# EAGLE schematic project (EAGLE 9.7.0)
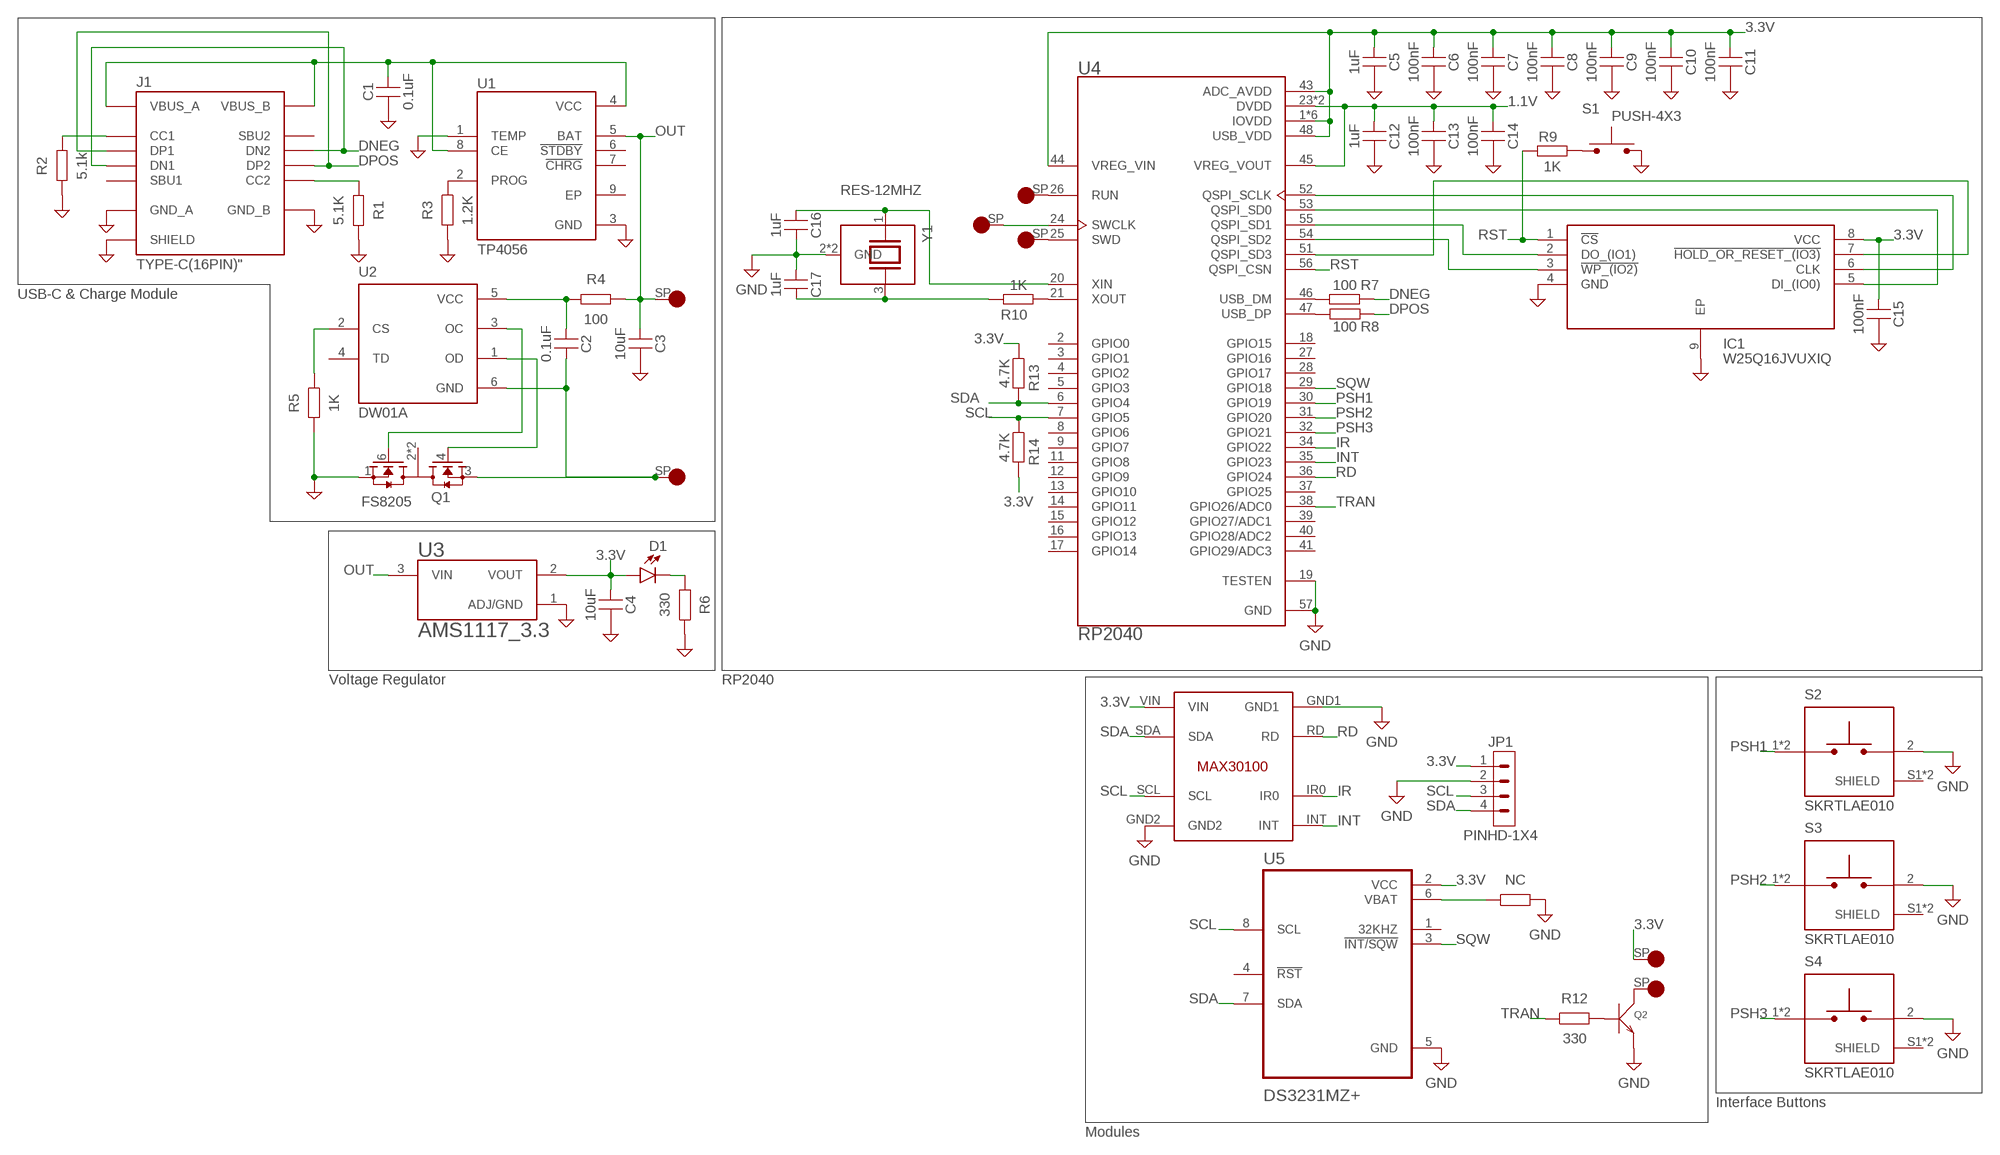
[diagram p0: schematic, sheet 1]

## Parts
B+  SOLDER_PAD_2MM  [SOLDER_PAD_2MM]
B-  SOLDER_PAD_2MM  [SOLDER_PAD_2MM]
C1  0.1uF  C_CHIP-0805(2012-METRIC)  [CAPC2012X110]
C2  0.1uF  C_CHIP-0805(2012-METRIC)  [CAPC2012X110]
C3  10uF  C_CHIP-0805(2012-METRIC)  [CAPC2012X110]
C4  10uF  C_CHIP-0805(2012-METRIC)  [CAPC2012X110]
C5  1uF  C_CHIP-0805(2012-METRIC)  [CAPC2012X110]
C6  100nF  C_CHIP-0805(2012-METRIC)  [CAPC2012X110]
C7  100nF  C_CHIP-0805(2012-METRIC)  [CAPC2012X110]
C8  100nF  C_CHIP-0805(2012-METRIC)  [CAPC2012X110]
C9  100nF  C_CHIP-0805(2012-METRIC)  [CAPC2012X110]
C10  100nF  C_CHIP-0805(2012-METRIC)  [CAPC2012X110]
C11  100nF  C_CHIP-0805(2012-METRIC)  [CAPC2012X110]
C12  1uF  C_CHIP-0805(2012-METRIC)  [CAPC2012X110]
C13  100nF  C_CHIP-0805(2012-METRIC)  [CAPC2012X110]
C14  100nF  C_CHIP-0805(2012-METRIC)  [CAPC2012X110]
C15  100nF  C_CHIP-0805(2012-METRIC)  [CAPC2012X110]
C16  1uF  C_CHIP-0805(2012-METRIC)  [CAPC2012X110]
C17  1uF  C_CHIP-0805(2012-METRIC)  [CAPC2012X110]
D1  LED0805  [LEDC2012X70N]
IC1  W25Q16JVUXIQ  [SON50P300X200X60-9N]
J1  TYPE-C(16PIN)"  [TYPE-C(16PIN)]
JP1  PINHD-1X4  [1X04]
NC  R_CHIP-0402(1005-METRIC)  [RESC1005X40]
Q1  FS8205  [SOT95P280X145-6N]
Q2  SMD-TRANSISTORS-NPN-25V-500MW(SOT-23)  [SOT-23]
R1  5.1K  R_CHIP-0805(2012-METRIC)  [RESC2012X65]
R2  5.1k  R_CHIP-0805(2012-METRIC)  [RESC2012X65]
R3  1.2K  R_CHIP-0805(2012-METRIC)  [RESC2012X65]
R4  100  R_CHIP-0805(2012-METRIC)  [RESC2012X65]
R5  1K  R_CHIP-0805(2012-METRIC)  [RESC2012X65]
R6  330  R_CHIP-0805(2012-METRIC)  [RESC2012X65]
R7  100  R_CHIP-0805(2012-METRIC)  [RESC2012X65]
R8  100  R_CHIP-0805(2012-METRIC)  [RESC2012X65]
R9  1K  R_CHIP-0805(2012-METRIC)  [RESC2012X65]
R10  1K  R_CHIP-0805(2012-METRIC)  [RESC2012X65]
R12  330  R_CHIP-0805(2012-METRIC)  [RESC2012X65]
R13  4.7K  R_CHIP-0805(2012-METRIC)  [RESC2012X65]
R14  4.7K  R_CHIP-0805(2012-METRIC)  [RESC2012X65]
S1  PUSH-4X3  [PUSH-4X3]
S2  SKRTLAE010  [SW_SKRTLAE010]
S3  SKRTLAE010  [SW_SKRTLAE010]
S4  SKRTLAE010  [SW_SKRTLAE010]
SP1  SOLDER_PAD_2MM  [SOLDER_PAD_2MM]
SP2  SOLDER_PAD_2MM  [SOLDER_PAD_2MM]
SP3  SOLDER_PAD_2MM  [SOLDER_PAD_2MM]
SP4  SOLDER_PAD_2MM  [SOLDER_PAD_2MM]
SP5  SOLDER_PAD_2MM  [SOLDER_PAD_2MM]
U1  TP4056  [SOP127P600X175-9N]
U2  DW01A  [SOT95P280X145-6N]
U3  AMS1117_3.3  [AMS1117_3.3]
U4  RP2040  [QFN40P700X700X90-57N]
U5  DS3231MZ+  [SOIC127P600X175-8N]
U$1  MAX30100MAX30100  [MAX30100]
Y1  RES-12MHZ  [RES-12MHZ]

## Nets
1.1V: C12.1 C13.1 C14.1 U4.23(DVDD) U4.45(VREG_VOUT) U4.50(DVDD)
3.3V: C4.1 C5.1 C6.1 C7.1 C8.1 C9.1 C10.1 C11.1 C15.1 D1.A IC1.8(VCC) JP1.1 R13.1 R14.2 SP5.SP(SP$1) U3.2(VOUT) U4.1(IOVDD) U4.10(IOVDD) U4.22(IOVDD) U4.33(IOVDD) U4.42(IOVDD) U4.43(ADC_AVDD) U4.44(VREG_VIN) U4.48(USB_VDD) U4.49(IOVDD) U5.2(VCC) U$1.VIN
5.0V: C1.2 J1.A4_B9(VBUS_A) J1.B4_A9(VBUS_B) U1.4(VCC) U1.8(CE)
B-: B-.SP(SP$1) C2.2 Q1.3(S2) U2.6(GND)
DNEG: J1.A7(DN1) J1.B7(DN2) R7.1
DPOS: J1.A6(DP1) J1.B6(DP2) R8.2
GND: C1.1 C3.2 C4.2 C5.2 C6.2 C7.2 C8.2 C9.2 C10.2 C11.2 C12.2 C13.2 C14.2 C15.2 C16.2 C17.1 IC1.4(GND) IC1.9(EP) J1.A1_B12(GND_A) J1.B1_A12(GND_B) J1.SH1(SHIELD) J1.SH2(SHIELD) J1.SH3(SHIELD) J1.SH4(SHIELD) JP1.2 NC.2 Q1.1(S1) Q2.2(E) R1.2 R2.1 R3.2 R5.2 R6.1 S1.2 S2.2 S3.2 S4.2 U1.1(TEMP) U1.3(GND) U3.1(ADJ/GND) U4.19(TESTEN) U4.57(GND) U5.5(GND) U$1.GND1 U$1.GND2 Y1.2(GND) Y1.4(GND)
INT: U4.35(GPIO23) U$1.INT
IR: U4.34(GPIO22) U$1.IR0
N$1: R3.1 U1.2(PROG)
N$2: D1.C R6.2
N$3: R7.2 U4.46(USB_DM)
N$4: J1.A5(CC1) R2.2
N$5: J1.B5(CC2) R1.1
N$6: R8.1 U4.47(USB_DP)
N$7: IC1.5(DI_(IO0)) U4.53(QSPI_SD0)
N$8: R5.1 U2.2(CS)
N$9: Q1.6(G1) U2.3(OC)
N$10: Q1.4(G2) U2.1(OD)
N$11: C2.1 R4.2 U2.5(VCC)
N$12: IC1.6(CLK) U4.52(QSPI_SCLK)
N$13: IC1.2(DO_(IO1)) U4.55(QSPI_SD1)
N$14: IC1.3(!WP_(IO2)) U4.54(QSPI_SD2)
N$15: IC1.7(!HOLD_OR_RESET_(IO3)) U4.51(QSPI_SD3)
N$16: R9.1 S1.1
N$17: SP1.SP(SP$1) U4.26(RUN)
N$18: SP2.SP(SP$1) U4.24(SWCLK)
N$19: SP3.SP(SP$1) U4.25(SWD)
N$20: R10.1 U4.21(XOUT)
N$21: C17.2 R10.2 Y1.3
N$22: C16.1 U4.20(XIN) Y1.1
N$23: Q2.1(B) R12.2
N$24: Q2.3(C) SP4.SP(SP$1)
N$32: NC.1 U5.6(VBAT)
OUT: B+.SP(SP$1) C3.1 R4.1 U1.5(BAT) U3.3(VIN)
PSH1: S2.1 S2.3 U4.30(GPIO19)
PSH2: S3.1 S3.3 U4.31(GPIO20)
PSH3: S4.1 S4.3 U4.32(GPIO21)
RD: U4.36(GPIO24) U$1.RD
RST: IC1.1(!CS) R9.2 U4.56(QSPI_CSN)
SCL: JP1.3 R14.1 U4.7(GPIO5) U5.8(SCL) U$1.SCL
SDA: JP1.4 R13.2 U4.6(GPIO4) U5.7(SDA) U$1.SDA
SQW: U4.29(GPIO18) U5.3(!INT/SQW)
TRAN: R12.1 U4.38(GPIO26/ADC0)
Unconnected: J1.A8(SBU1) J1.B8(SBU2) Q1.2(D12) Q1.5(D12) S2.S1(SHIELD) S2.S2(SHIELD) S3.S1(SHIELD) S3.S2(SHIELD) S4.S1(SHIELD) S4.S2(SHIELD) U1.6(!STDBY) U1.7(!CHRG) U1.9(EP) U2.4(TD) U4.2(GPIO0) U4.3(GPIO1) U4.4(GPIO2) U4.5(GPIO3) U4.8(GPIO6) U4.9(GPIO7) U4.11(GPIO8) U4.12(GPIO9) U4.13(GPIO10) U4.14(GPIO11) U4.15(GPIO12) U4.16(GPIO13) U4.17(GPIO14) U4.18(GPIO15) U4.27(GPIO16) U4.28(GPIO17) U4.37(GPIO25) U4.39(GPIO27/ADC1) U4.40(GPIO28/ADC2) U4.41(GPIO29/ADC3) U5.1(32KHZ) U5.4(!RST)

## Notes on the sheet
- USB-C & Charge Module
- Voltage Regulator | RP2040
- Interface Buttons
- Modules

## Library data of the parts
B+ B- SP1-SP5 = SOLDER PAD:SOLDER_PAD_2MM
C1-C17 = Capacitor:C: Capacitor - Generic
D1 = LED 0805:LED0805: Check availability <https://pricing.snapeda.com/parts/597-3305-607F/Dialight/view-part?ref=eda>
IC1 = W25Q16JVUXIQ:W25Q16JVUXIQ: Check availability <https://pricing.snapeda.com/parts/W25Q16JVUXIQ/Winbond/view-part?ref=eda>
J1 = TYPE-C USB:TYPE-C(16PIN): Check availability <https://pricing.snapeda.com/parts/TYPE-C%2016PIN%202MD%20%28073%29/Shouhan/view-part?ref=eda>
JP1 = Connector:PINHD-1X4: Pin Header
NC R1-R10 R12-R14 = Resistor:R: Resistor Fixed - Generic
Q1 = FS8205:FS8205: Check availability <https://pricing.snapeda.com/parts/FS8205/Fortune%20Semiconductor/view-part?ref=eda>
Q2 = S8050:SMD-TRANSISTORS-NPN-25V-500MW(SOT-23): Check availability <https://pricing.snapeda.com/parts/S8050/MDD/view-part?ref=eda>
S1 = PUSH 4x3mm:PUSH-4X3: Check availability <https://pricing.snapeda.com/parts/TL1015AF160QG/E-Switch/view-part?ref=eda>
S2-S4 = PUSH LATERAL:SKRTLAE010: Check availability <https://pricing.snapeda.com/parts/SKRTLAE010/ALPS/view-part?ref=eda>
U1 = TP4056:TP4056: Check availability <https://pricing.snapeda.com/parts/TP4056/NanJing%20Top%20Power%20ASIC%20Corp./view-part?ref=eda>
U2 = DW01A:DW01A: Check availability <https://pricing.snapeda.com/parts/DW01A/Fortune%20Semiconductor/view-part?ref=eda>
U3 = VOL REGS:AMS1117_3.3: Check availability <https://pricing.snapeda.com/parts/AMS1117-3.3/UMW/view-part?ref=eda>
U4 = RP2040:RP2040: Check availability <https://pricing.snapeda.com/parts/RP2040/Raspberry%20Pi/view-part?ref=eda>
U5 = DS3231MZ:DS3231MZ+: Check availability <https://pricing.snapeda.com/parts/DS3231MZ%2B/Analog%20Devices/view-part?ref=eda>
U$1 = MAX30100:MAX30100
Y1 = RESONATORS:RES-12MHZ: Check availability <https://pricing.snapeda.com/parts/C5S-12.000-16-3030-X-R/Aker%20Technology%20USA/view-part?ref=eda>